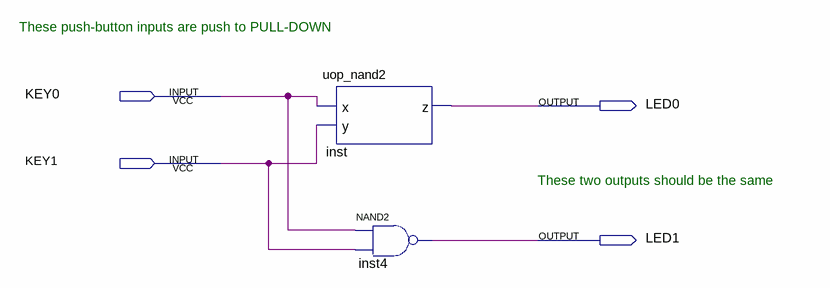
[diagram p0: schematic sheet]
// Quartus schematic comb_logictask.bdf as structural Verilog: 2 symbols, 4 pins
module comb_logictask (
  input  KEY0,
  input  KEY1,
  output LED0,
  output LED1
);

  uop_nand2 inst (.x(KEY0), .y(KEY1), .z(LED0));
  nand inst4 (LED1, KEY0, KEY1);

  // Notes on the sheet:
  //   These push-button inputs are push to PULL-DOWN
  //   These two outputs should be the same
endmodule
